# EAGLE design tda2030 (EAGLE 8.6.0)
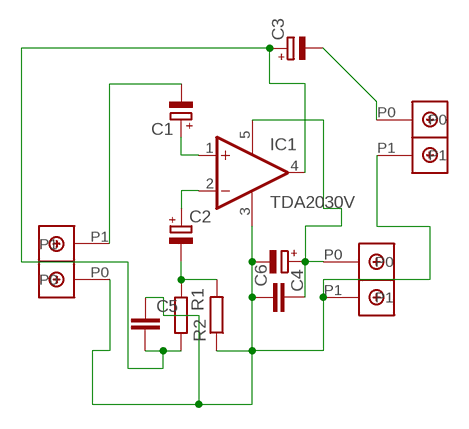
[diagram p0: schematic, sheet 1]

## Parts
12V  DBCONN-1X2  [DBCONN-1X2]
AUDIOIN  DBCONN-1X2  [DBCONN-1X2]
C1  CPOL-EUE2.5-6  [E2,5-6]
C2  CPOL-EUE3.5-8  [E3,5-8]
C3  CPOL-EUE3.5-10  [E3,5-10]
C4  CPOL-EUE3.5-10  [E3,5-10]
C5  C-EU050-025X075  [C050-025X075]
C6  C-EU050-025X075  [C050-025X075]
IC1  TDA2030V  [CB360]
R1  R-EU_0204/7  [0204/7]
R2  R-EU_0204/2V  [0204V]
SPEAKER  DBCONN-1X2  [DBCONN-1X2]

## Nets
N$1: C1.+ IC1.1(+IN)
N$2: C2.+ IC1.2(-IN)
N$3: C3.+ C5.2 IC1.4(OUT) R1.2
N$4: 12V.P1 AUDIOIN.P0 C4.- C5.1 C6.1 IC1.3(GND) R2.1 SPEAKER.P1
N$5: C2.- R1.1 R2.2
N$6: 12V.P0 C4.+ C6.2 IC1.5(V+)
N$9: AUDIOIN.P1 C1.-
N$10: C3.- SPEAKER.P0

## Library data of the parts
12V AUDIOIN SPEAKER = Terminal Block Connector:DBCONN-1X2
C1-C4 = resistor:CPOL-EU: POLARIZED CAPACITOR, European symbol
C5 C6 = rcl:C-EU: CAPACITOR, European symbol; SPICEPREFIX: C
IC1 = Audio-Power-amlifier:TDA2030: Power OP AMP
R1 R2 = rcl:R-EU_: RESISTOR, European symbol; SPICEPREFIX: R

## Board
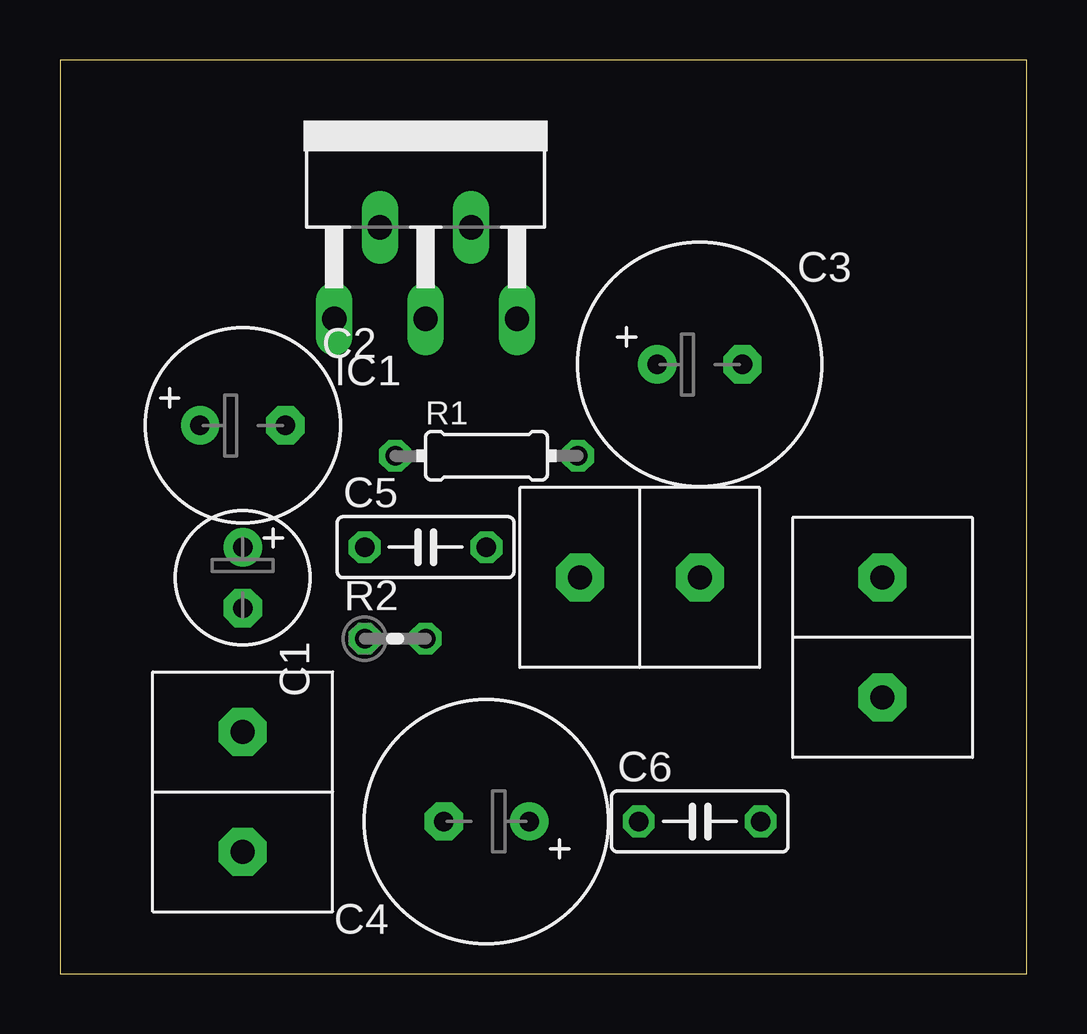
[diagram p1: board, top side]
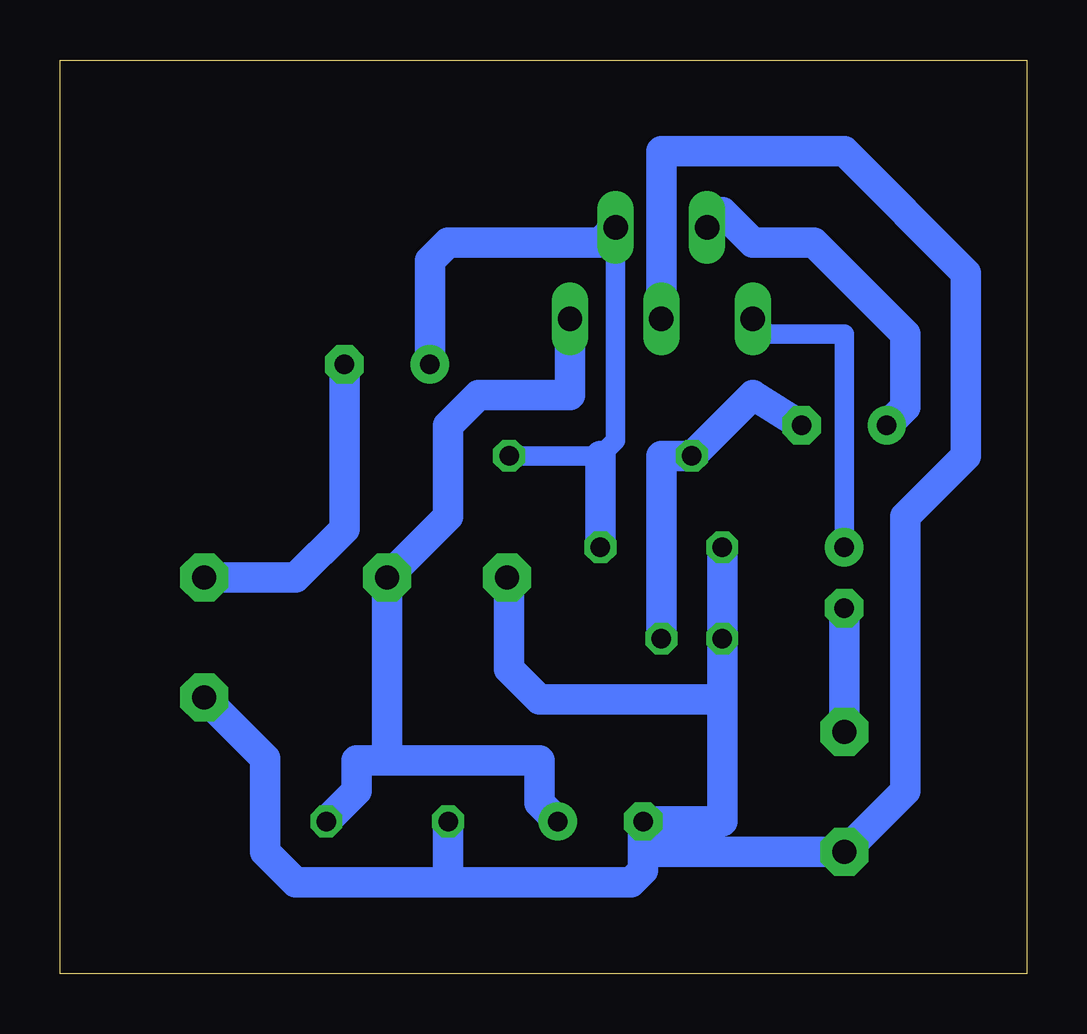
[diagram p2: board, bottom side, seen from below]

Size 40.31 x 38.09 mm. Coordinates in mm from the lower left corner, seen from the top.
Outline: 0,0 40.31,0 40.31,38.09 0,38.09 0,0
Copper layers (1*16): Top 0.035mm / dielectric 1.5mm / Bottom 0.035mm
Design rules "default": minimum track width 6mil, minimum drill 0.35mm, track to track 6mil, track to pad 6mil, pad to pad 6mil, via to via 6mil, smd to smd 6mil, copper to edge 40mil, drill to drill 6mil, minimum pad ring 10mil, minimum via ring 8mil, stop-mask expansion 4mil, vias tented up to drill 0mil, thermal gap 10mil

### Footprints (pad centres in the part's own frame; a part is rotated, then mirrored left to right if it is on the bottom)
DBCONN-1X2 = drill 1 pad 2 octagon: P0 -2.54,0; P1 2.46,0
E2,5-6 = drill 0.813 pad 1.6: + -1.27,0 | drill 0.813 pad 1.6 octagon: - 1.27,0
E3,5-8 = drill 0.813 pad 1.6: + -1.778,0 | drill 0.813 pad 1.6 octagon: - 1.778,0
E3,5-10 = drill 0.813 pad 1.6: + -1.778,0 | drill 0.813 pad 1.6 octagon: - 1.778,0
C050-025X075 = drill 0.813 octagon: 1 -2.54,0; 2 2.54,0
CB360 = drill 1.016 long: 1 -3.81,-8.255; 2 -1.905,-4.445; 3 0,-8.255; 4 1.905,-4.445; 5 3.81,-8.255
0204/7 = drill 0.813 octagon: 1 -3.81,0; 2 3.81,0
0204V = drill 0.813 octagon: 1 -1.27,0; 2 1.27,0

### Placement (x,y rotation side)
12V  24.13,16.51 180 top
AUDIOIN  7.62,7.62 90 top
C1  7.62,16.51 270 top
C2  7.62,22.86 0 top
C3  26.67,25.4 0 top
C4  17.78,6.35 180 top
C5  15.24,17.78 0 top
C6  26.67,6.35 0 top
IC1  15.24,35.56 0 top
R1  17.78,21.59 0 top
R2  13.97,13.97 0 top
SPEAKER  34.29,13.97 270 top

### Tracks (layer width: path | path; a pad name or v marks a point on that pad's centre or on a via)
N$1
  Bottom 0.813: C1.+ 7.62,26.67 10.79,26.67 IC1.1
N$2
  Bottom 1.27: IC1.2 12.7,31.75 11.43,30.48 8.89,30.48 5.08,26.67 5.08,23.62 C2.+
N$3
  Bottom 0.813: IC1.4 17.14,22.23 17.78,21.59 R1.2
  Bottom 1.27: IC1.4 17.78,30.48 24.13,30.48 24.89,29.72 C3.+ | C5.2 17.78,21.59
N$4
  Bottom 1.27: 12.7,11.43 12.7,6.35 C4.- 16,5.08 | 12.7,11.43 R2.1 C5.1 | IC1.3 15.24,34.29 7.62,34.29 2.54,29.21 2.54,21.59 5.08,19.05 5.08,7.62 AUDIOIN.P0 16,5.08 | 16,5.08 16,4.32 16.51,3.81 24.13,3.81 | SPEAKER.P1 31.75,8.97 31.75,5.08 30.48,3.81 24.13,3.81 | C6.1 24.13,3.81 | 12V.P1 21.59,16.43 21.59,12.7 20.32,11.43 12.7,11.43
N$5
  Bottom 1.27: R2.2 15.24,21.59 R1.1 11.43,24.13 C2.-
N$6
  Bottom 1.27: IC1.5 19.05,24.13 22.86,24.13 24.13,22.86 24.13,19.05 12V.P0 26.67,8.89 | C4.+ 20.32,7.11 20.32,8.89 26.67,8.89 | 26.67,8.89 27.94,8.89 27.94,7.62 C6.2
N$9
  Bottom 1.27: AUDIOIN.P1 C1.-
N$10
  Bottom 1.27: SPEAKER.P0 30.48,16.51 28.45,18.54 C3.-